# Altium schematic sheet Sheet1.SchDoc
size A4; SheetNumber: 1; SheetTotal: 1; SPICEModelCacheYDCUQUFS: <root> / <DocumentId>YDCUQUFS</DocumentId> / <CacheFrame Number="0"> / <Model Name="adc8" Kind="MDL"> / <Text>* 8-Bit generic A/D converter / * INPUTS  VCC, GND, VIN, VRP, VRM, SC, OE; / * OUTPUTS VCC_LD, SC_LD, OE_LD, OC, D0, D1, D2, D3, D4, D5, D6, D7; / .MODEL ADC8 xsimcode(file="{MODEL_PATH}ADC8.scb" func=ADC8 {mntymx})</Text> / </Model> / </CacheFrame> / </root>
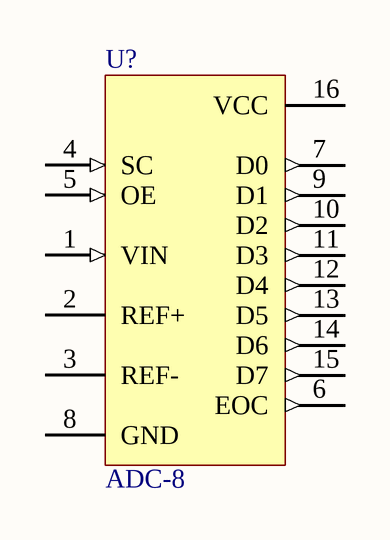
[diagram p0: Sheet1.SchDoc]

## Parts
U?  ADC-8  [SOT403-1_N]

## Nets

Not connected (* = marked no-connect by the designer): U? 1(VIN) 2(REF+) 3(REF-) 4(SC) 5(OE) 6(EOC) 7(D0) 8(GND) 9(D1) 10(D2) 11(D3) 12(D4) 13(D5) 14(D6) 15(D7) 16(VCC)

## Library data of the parts
U? = ADC-8: Generic 8-Bit A/D Converter; Published: 8-Jun-2000; LatestRevisionDate: 29-May-2009; LatestRevisionNote: IPC-7351 Footprint Added.; PackageVersion: Mar-2002; PackageReference: SOT403-1; Publisher: Altium Limited; PackageDescription: 16-Pin Thin Small Outline Package 0.65 mm Pitch; Code_JEDEC: MO-153